# Altium schematic sheet Thruster Board.SchDoc
size A; Organization: Underwater Robotics; Address1: c/o Student Involvement; Address2: Campus Box 7306; Address3: 2016 Cates Ave. Raleigh, NC 27695; Revision: A1; SheetNumber: 1F; SheetTotal: 5F
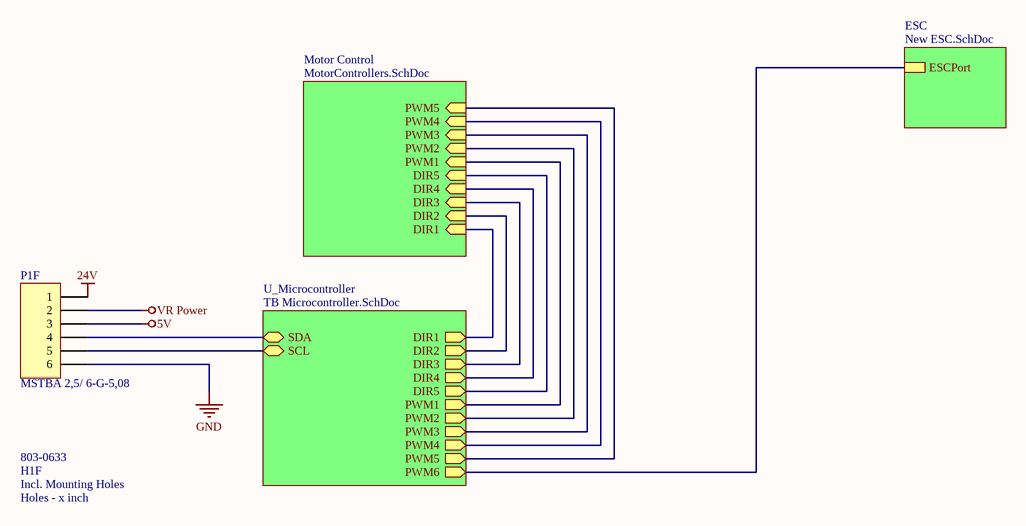
[diagram p0: Thruster Board.SchDoc]

## Parts
H1F  Holes - x inch  Supplier Part Number 1: 803-0633  [110mil Holes - 1.6 Inch]
P1F  MSTBA 2,5/ 6-G-5,08  [MSTBA 2,5 6-G-5,08]

## Sub-sheets
ESC = New ESC.SchDoc: ESCPort
Motor Control = MotorControllers.SchDoc: PWM1 (in), PWM2 (in), PWM3 (in), PWM4 (in), PWM5 (in), DIR1 (in), DIR2 (in), DIR3 (in), DIR4 (in), DIR5 (in)
U_Microcontroller = TB Microcontroller.SchDoc: PWM1 (out), PWM2 (out), PWM3 (out), PWM4 (out), PWM5 (out), PWM6 (out), DIR1 (out), DIR2 (out), DIR3 (out), DIR4 (out), DIR5 (out), SDA (bidir), SCL (bidir)

## Nets
5V: P1F.3
24V: P1F.1
GND: P1F.6
VR Power: P1F.2
NetP1F_4: P1F.4 ; sheet U_Microcontroller/SDA
NetP1F_5: P1F.5 ; sheet U_Microcontroller/SCL
(unnamed): sheet U_Microcontroller/PWM1, sheet Motor Control/PWM1
(unnamed): sheet U_Microcontroller/PWM2, sheet Motor Control/PWM2
(unnamed): sheet U_Microcontroller/PWM3, sheet Motor Control/PWM3
(unnamed): sheet U_Microcontroller/PWM4, sheet Motor Control/PWM4
(unnamed): sheet U_Microcontroller/PWM5, sheet Motor Control/PWM5
(unnamed): sheet U_Microcontroller/PWM6, sheet ESC/ESCPort
(unnamed): sheet U_Microcontroller/DIR1, sheet Motor Control/DIR1
(unnamed): sheet U_Microcontroller/DIR2, sheet Motor Control/DIR2
(unnamed): sheet U_Microcontroller/DIR3, sheet Motor Control/DIR3
(unnamed): sheet U_Microcontroller/DIR4, sheet Motor Control/DIR4
(unnamed): sheet U_Microcontroller/DIR5, sheet Motor Control/DIR5

## Notes on the sheet
- Title
- Size:
- Date:
- A
- Number:
- Time:
- Revision:
- Sheet
- of
- File:
- (in symbol Holes - x inch) Incl. Mounting Holes

## Library data of the parts
P1F = MSTBA 2,5/ 6-G-5,08: Header, 6-Pin; Manufacturer 1: Phoenix Contact; Manufacturer Part Number: 1757284; Description 1: Pluggable Terminal Blocks 6 Pos 5.08mm pitch Through Hole Header; Current Rating: 12 A; Number of Positions: 6 Position; Voltage Rating: 250 V; Pitch: 5.08 mm; Supplier 1: Mouser; Supplier Part Number 1: 651-1757284; RoHS: RoHS Compliant; Category: Pluggable Terminal Blocks; Stock 1: 1398; Pricing 1: 1=2.64, 10=2.56, 25=2.51, 50=2.50, 100=2.34, 200=2.14, 500=1.98, 1000=1.89, 2000=1.76 (AUD); Color: Gray; Contact Plating: Tin; Housing Material: Polybutylene Terephthalate (PBT); Packaging: Bulk; Product: Headers; Series: MSTBA; Termination Style: Through Hole; Brand: Phoenix Contact; Flammability Rating: UL 94 V-0; Product Category: Pluggable Standard Terminal Blocks; Standard Pack Qty: 50; Tradename: COMBICON Control; RoHS - Mouser: Y; Minimum Order Quantity: 1; Reeling: False; ComponentLink1URL: http://www.phoenixcontact.com/us/products/1757284/pdf; ComponentLink1Description: http://www.phoenixcontact.com/us/products/1757284/pdf
H1F = Holes - x inch: Supplier 1: RSComponents